# EAGLE design smd_missing_pulse_detector (EAGLE 9.6.2)
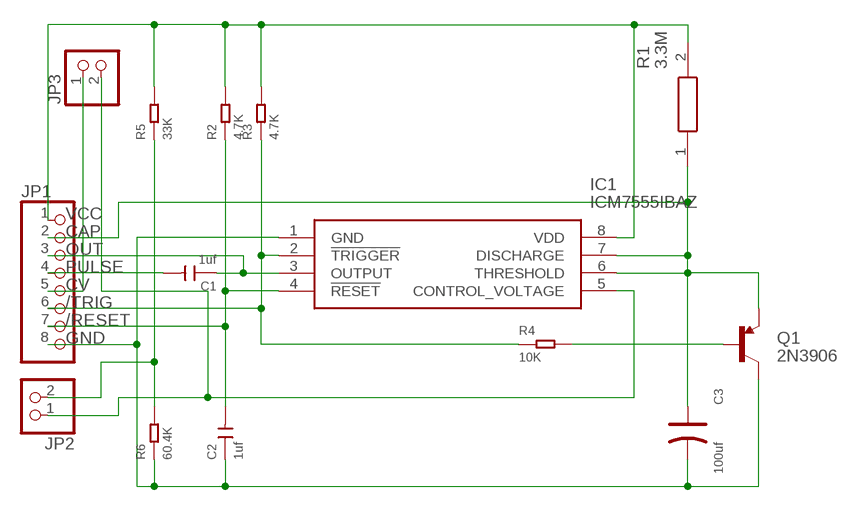
[diagram p0: schematic, sheet 1]

## Parts
C1  1uf  CERAMIC-1UF-25V-10%-X7R(0805)  [C0805]
C2  1uf  CERAMIC-1UF-25V-10%-X7R(0805)  [C0805]
C3  100uf  TANTALUM-SMD-100UF-10V(AVX-B)  [AVX-B]
IC1  ICM7555IBAZ  [SOIC127P600X175-8N]
JP1  PINHD-1X8  [1X08]
JP2  PINHD-1X2  [1X02]
JP3  PINHD-1X2  [1X02]
Q1  2N3906  TRANSISTOR_PNPPMBT3906  [SOT23-3]
R1  3.3M  CRCW06033M30FKEA  [RESC1608X50N]
R2  4.7K  SMD-RES-4.7K-5%-1/10W(0603)  [R0603]
R3  4.7K  SMD-RES-4.7K-5%-1/10W(0603)  [R0603]
R4  10K  SMD-RES-10K-1%-1/10W(0603)  [R0603]
R5  33K  SMD-RES-4.7K-5%-1/10W(0603)  [R0603]
R6  60.4K  SMD-RES-4.7K-5%-1/10W(0603)  [R0603]

## Nets
/RESET: C2.2 IC1.4(!RESET) JP1.7 R2.1
/TRIG: IC1.2(!TRIGGER) JP1.6 R3.1 R4.1
CAP: C3.+ IC1.6(THRESHOLD) IC1.7(DISCHARGE) JP1.2 Q1.2(E) R1.1
CV: IC1.5(CONTROL_VOLTAGE) JP2.1 JP3.2
GND: C2.1 C3.- IC1.1(GND) JP1.8 Q1.3(C) R6.1
N$1: Q1.1(B) R4.2
N$2: JP2.2 R5.1 R6.2
N$3: JP1.5 JP3.1
OUT: C1.1 IC1.3(OUTPUT) JP1.3
PULSE: C1.2 JP1.4
VCC: IC1.8(VDD) JP1.1 R1.2 R2.2 R3.2 R5.2

## Library data of the parts
C1 C2 = OPL_Capacitor:CERAMIC-1UF-25V-10%-X7R(0805): 302010179; MPN: CC0805KKX7R8BB105
C3 = OPL_Capacitor:TANTALUM-SMD-100UF-10V(AVX-B): 302020015; MPN: TAJB107M010#NJ
IC1 = ICM7555IBAZ:ICM7555IBAZ: ICM7555IBAZ, General Purpose Timer 1MHz, 2 to 18V, 8-Pin SOIC-8 Source: Datasheet <https://datasheet.datasheetarchive.com/originals/distributors/SFDatasheet-6/sf-000136291.pdf>; ARROW_PART_NUMBER: ICM7555IBAZ; ARROW_PRICE-STOCK: https://www.arrow.com/en/products/icm7555ibaz/intersil; DESCRIPTION: ICM7555IBAZ, General Purpose Timer 1MHz, 2 to 18V, 8-Pin SOIC-8; HEIGHT: 1.75mm; MANUFACTURER_NAME: Intersil; MANUFACTURER_PART_NUMBER: ICM7555IBAZ; MOUSER_PART_NUMBER: 968-ICM7555IBAZ; MOUSER_PRICE-STOCK: https://www.mouser.com/Search/ProductDetail.aspx?qs=9fLuogzTs8Jv0Cw4QvRWRA%3d%3d
JP1 = Connector:PINHD-1X8: PIN HEADER; CATEGORY: CONNECTOR; SUB-CATEGORY: PIN-HEADER
JP2 JP3 = Connector:PINHD-1X2: PIN HEADER; CATEGORY: CONNECTOR; SUB-CATEGORY: PIN-HEADER
Q1 = User-Submitted:TRANSISTOR_PNP: Generic PNP BJT Double check pinouts against datasheets- not all devices are the same! MMBT3906 - 40V 200mA SOT-23 (TRANS-08052) MMBT4403 - 40V 600mA SOT-23 (TRANS-09245); PROD_ID: TRANS-08052; VALUE: PMBT3906
R1 = CRCW06033M30FKEA:CRCW06033M30FKEA: CRCW0603 Resistor T/R 0.10W,1%,3M3 Vishay CRCW Series Thick Film Surface Mount Resistor 0603 Case 3.3M +/-1% 0.1W +/-100ppm/C Source: Datasheet <http://www.vishay.com/docs/20035/dcrcwe3.pdf>; ARROW_PART_NUMBER: CRCW06033M30FKEA; ARROW_PRICE-STOCK: https://www.arrow.com/en/products/crcw06033m30fkea/vishay; DESCRIPTION: CRCW0603 Resistor T/R 0.10W,1%,3M3 Vishay CRCW Series Thick Film Surface Mount Resistor 0603 Case 3.3M +/-1% 0.1W +/-100ppm/C; HEIGHT: 0.5mm; MANUFACTURER_NAME: Vishay; MANUFACTURER_PART_NUMBER: CRCW06033M30FKEA; MOUSER_PART_NUMBER: 71-CRCW06033M30FKEA; MOUSER_PRICE-STOCK: https://www.mouser.co.uk/ProductDetail/Vishay-Dale/CRCW06033M30FKEA?qs=xDiHhyYQ5oswxJh74ZTuZg%3D%3D
R2 R3 = OPL_Resistor:SMD-RES-4.7K-5%-1/10W(0603): 301010290; MPN: RC0603JR-074K7L
R4 = OPL_Resistor:SMD-RES-10K-1%-1/10W(0603): 301011970; MPN: RC0603FR-0710KL
R5 R6 = OPL_Resistor:SMD-RES-4.7K-5%-1/10W(0603): 301010290; MPN: RC0603JR-074K7L; VALUE: 4.7K

## Board
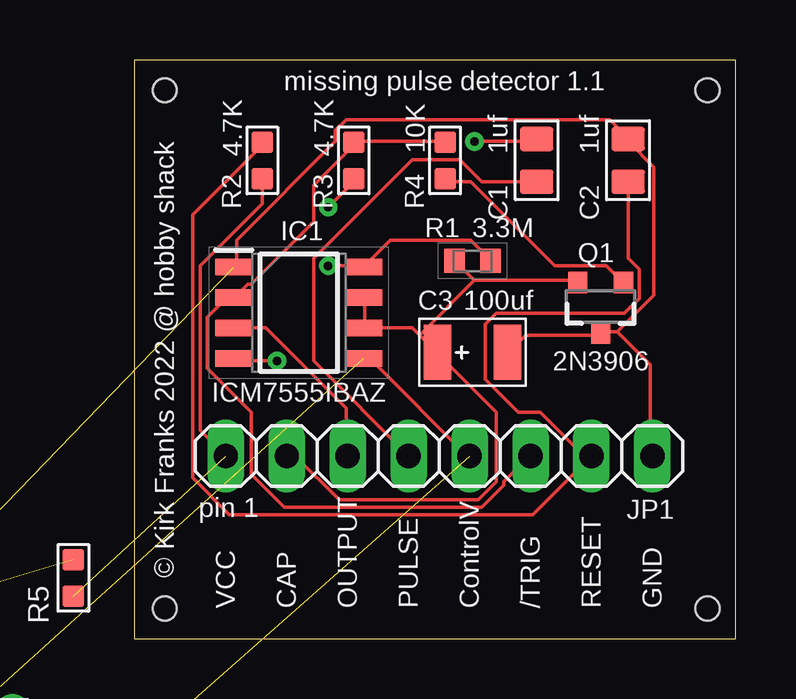
[diagram p1: board, top side]
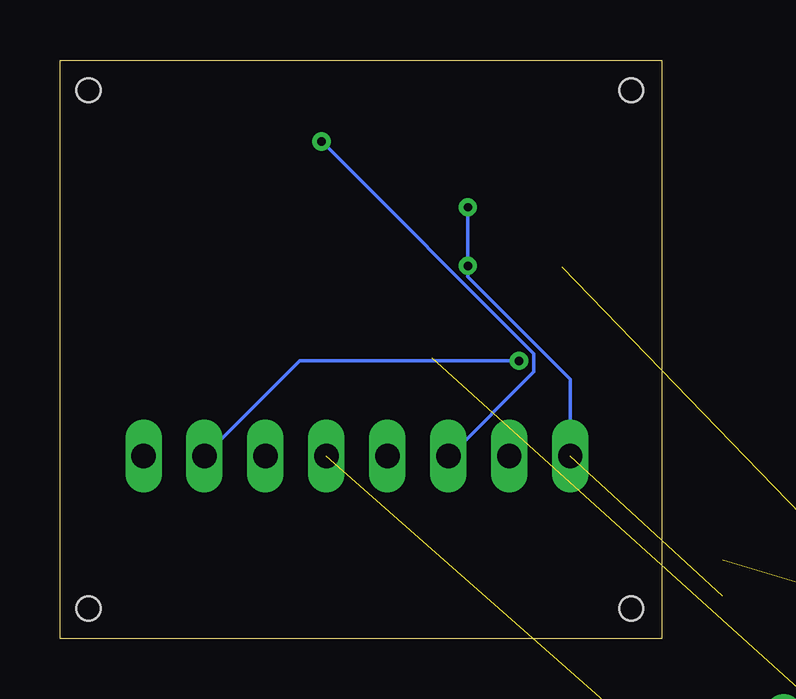
[diagram p2: board, bottom side, seen from below]

Size 25.07 x 24.12 mm. Coordinates in mm from the lower left corner, seen from the top.
Outline: 0,0 25.07,0 25.07,24.12 0,24.12 0,0
Copper layers (1*16): Top 0.035mm / dielectric 1.5mm / Bottom 0.035mm
Design rules "default": minimum track width 6mil, minimum drill 0.35mm, track to track 6mil, track to pad 6mil, pad to pad 6mil, via to via 6mil, smd to smd 6mil, copper to edge 40mil, drill to drill 6mil, minimum pad ring 10mil, minimum via ring 8mil, stop-mask expansion 4mil, vias tented up to drill 0mil, thermal gap 10mil
Holes 1 mm at 1.27,22.86 1.27,1.27 23.88,1.27 23.88,22.86

### Footprints (pad centres in the part's own frame; a part is rotated, then mirrored left to right if it is on the bottom)
C0805 = smd 1.397 x 1.016: 1 0,0.889; 2 0,-0.889
AVX-B = smd 1.143 x 2.286: + -1.46,0; - 1.46,0
SOIC127P600X175-8N = smd 1.525 x 0.7: 1 -2.712,1.905; 2 -2.712,0.635; 3 -2.712,-0.635; 4 -2.712,-1.905; 5 2.712,-1.905; 6 2.712,-0.635; 7 2.712,0.635; 8 2.712,1.905
1X08 = drill 1.016 long: 1 -8.89,0; 2 -6.35,0; 3 -3.81,0; 4 -1.27,0; 5 1.27,0; 6 3.81,0; 7 6.35,0; 8 8.89,0
1X02 = drill 1.016 long: 1 -1.27,0; 2 1.27,0
SOT23-3 = smd 0.8 x 0.9: 1 -0.95,-1; 2 0.95,-1; 3 0,1.1
RESC1608X50N = smd 0.85 x 1: 1 -0.75,0; 2 0.75,0
R0603 = smd 0.889 x 0.889: 1 0,0.762; 2 0,-0.762

### Placement (x,y rotation side)
C1  16.76,19.94 0 top
C2  20.57,19.94 0 top
C3  14.1,11.94 0 top
IC1  6.86,13.59 0 top
JP1  12.7,7.62 0 top
JP2  -6.35,-3.81 0 top  (outside the outline)
JP3  -6.35,-11.43 0 top  (outside the outline)
Q1  19.43,13.84 180 top
R1  14.1,15.75 0 top
R2  5.33,19.94 0 top
R3  9.14,19.94 0 top
R4  12.95,19.94 0 top
R5  -2.54,2.54 0 top
R6  -7.62,2.54 0 top  (outside the outline)

### Tracks (layer width: path | path; a pad name or v marks a point on that pad's centre or on a via)
/RESET  (via drill 0.35)
  Top 0.152: 18.9,7.47 16.61,5.18 3.96,5.18 2.44,6.71 2.44,17.68 5.33,20.57 R2.1 | C2.2 20.57,15.85 21.03,15.39 21.03,14.17 20.42,13.56 15.09,13.56 14.63,13.11 14.63,10.82 16,9.45 16.92,9.45 18.9,7.47 | 18.9,7.47 JP1.7 | v5.94,11.58 4.27,11.58 IC1.4
  Bottom 0.152: v5.94,11.58 15.09,11.58 JP1.7
/TRIG
  Top 0.152: R4.1 12.95,20.73 9.14,20.73 R3.1 9.14,20.57 7.47,18.9 7.47,17.37 4.88,14.78 4.72,14.78 4.27,14.33 IC1.2 4.12,14.17 3.81,14.17 3.05,13.41 3.05,11.28 4.88,9.45 4.88,6.86 6.25,5.49 14.48,5.49 15.39,6.4 15.39,6.55 16.46,7.62 JP1.6
CAP
  Top 0.152: 14.17,14.94 18.44,14.94 Q1.2 | 14.17,14.94 13.41,15.7 R1.1 | 9.6,12.95 9.6,14.17 IC1.7 | 9.6,12.95 11.58,12.95 11.89,12.65 | 11.89,12.65 12.5,12.04 C3.+ 12.65,11.89 15.09,9.45 15.09,6.55 14.33,5.79 8.53,5.79 6.71,7.62 JP1.2 | 9.6,12.95 IC1.6 | 11.89,12.65 14.17,14.94
CV  (2 unrouted)
  Top 0.152: 13.87,7.62 9.91,11.58 9.6,11.58 IC1.5
GND  (1 unrouted)
  Top 0.152: C3.- 15.7,12.04 16.31,12.65 19.36,12.65 Q1.3 19.51,12.8 20.12,12.8 | 20.12,12.8 21.64,14.33 21.64,19.66 20.57,20.73 C2.1 20.57,20.88 19.81,21.64 8.84,21.64 8.38,21.18 8.38,20.73 4.27,16.61 4.27,15.54 IC1.1 | 20.12,12.8 21.49,11.43 21.49,7.62 JP1.8
N$1
  Top 0.152: R4.2 12.95,19.05 14.02,19.05 17.53,15.54 19.66,15.54 20.27,14.94 Q1.1
N$2  (2 unrouted)
N$3  (1 unrouted)
OUT  (via drill 0.35)
  Top 0.152: v14.17,20.73 16.76,20.73 C1.1 | IC1.3 5.49,12.95 8.84,9.6 8.84,7.62 JP1.3
  Bottom 0.152: v14.17,20.73 5.33,11.89 5.33,11.12 8.84,7.62 JP1.3
PULSE
  Top 0.152: C1.2 14.48,19.05 13.56,19.96 11.58,19.96 7.47,15.85 7.47,11.58 JP1.4
VCC  (via drill 0.35)  (1 unrouted)
  Top 0.152: R1.2 14.78,15.85 14.02,16.61 10.67,16.61 9.6,15.54 IC1.8 9.45,15.54 v8.08,15.54 | R2.2 5.33,18.14 2.74,15.54 2.74,8.69 JP1.1 | v8.08,17.98 9.14,19.05 R3.2
  Bottom 0.152: v8.08,17.98 v8.08,15.54 8.08,15.09 3.81,10.82 JP1.1

### Text on the board
tPlace: missing pulse detector 1.1 | pin 1 | © Kirk Franks 2022 @ hobby shack | VCC | CAP | OUTPUT | PULSE | ControlV | /TRIG | RESET | GND